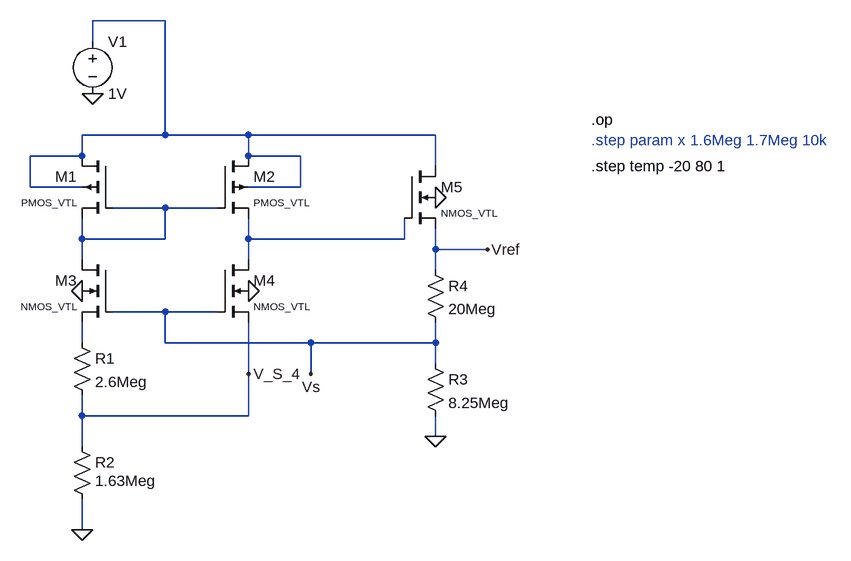
[diagram p0: schematic ptat_first_version.asc]
ptat_first_version.asc, the LTspice schematic file:
Version 4
SHEET 1 2136 772
WIRE 192 -32 80 -32
WIRE 80 0 80 -32
WIRE 192 144 192 -32
WIRE 192 144 64 144
WIRE 320 144 192 144
WIRE 608 144 320 144
WIRE 64 176 64 144
WIRE 64 176 -16 176
WIRE 320 176 320 144
WIRE 400 176 320 176
WIRE 608 192 608 144
WIRE -16 224 -16 176
WIRE 64 224 -16 224
WIRE 400 224 400 176
WIRE 400 224 320 224
WIRE 192 256 112 256
WIRE 272 256 192 256
WIRE 64 304 64 272
WIRE 192 304 192 256
WIRE 192 304 64 304
WIRE 320 304 320 272
WIRE 560 304 560 272
WIRE 560 304 320 304
WIRE 608 320 608 288
WIRE 688 320 608 320
WIRE 64 336 64 304
WIRE 320 336 320 304
WIRE 608 352 608 320
WIRE 192 416 112 416
WIRE 272 416 192 416
WIRE 64 464 64 432
WIRE 192 464 192 416
WIRE 416 464 192 464
WIRE 608 464 608 432
WIRE 608 464 416 464
WIRE 608 496 608 464
WIRE 320 512 320 432
WIRE 416 512 416 464
WIRE 64 576 64 544
WIRE 320 576 320 512
WIRE 320 576 64 576
WIRE 608 608 608 576
WIRE 64 624 64 576
WIRE 64 752 64 704
FLAG 80 80 0
FLAG 64 752 0
FLAG 416 512 Vs
FLAG 608 608 0
FLAG 688 320 Vref
FLAG 320 384 0
FLAG 64 384 0
FLAG 608 240 0
FLAG 320 512 V_S_4
SYMBOL pmos4 112 176 M0
WINDOW 3 56 72 Left 1
SYMATTR Value PMOS_VTL
SYMATTR InstName M1
SYMATTR Value2 l=150n w=1u
SYMBOL pmos4 272 176 R0
WINDOW 3 56 72 Left 1
SYMATTR Value PMOS_VTL
SYMATTR InstName M2
SYMATTR Value2 l=150n w=1u
SYMBOL voltage 80 -16 R0
SYMATTR InstName V1
SYMATTR Value 1V
SYMBOL nmos4 112 336 M0
WINDOW 3 56 72 Left 1
SYMATTR Value NMOS_VTL
SYMATTR InstName M3
SYMATTR Value2 l=55n w=1u m=11
SYMBOL nmos4 272 336 R0
WINDOW 3 56 72 Left 1
SYMATTR Value NMOS_VTL
SYMATTR InstName M4
SYMATTR Value2 l=55n w=1u
SYMBOL res 48 448 R0
SYMATTR InstName R1
SYMATTR Value 2.6Meg
SYMBOL res 48 608 R0
WINDOW 3 36 68 Left 2
SYMATTR Value 1.63Meg
SYMATTR InstName R2
SYMBOL res 592 480 R0
SYMATTR InstName R3
SYMATTR Value 8.25Meg
SYMBOL res 592 336 R0
SYMATTR InstName R4
SYMATTR Value 20Meg
SYMBOL nmos4 560 192 R0
WINDOW 3 56 72 Left 1
SYMATTR Value NMOS_VTL
SYMATTR InstName M5
SYMATTR Value2 l=55n w=1u
TEXT 848 192 Left 2 !.step temp -20 80 1
TEXT 848 152 Left 2 ;.step param x 1.6Meg 1.7Meg 10k
TEXT 848 120 Left 2 !.op

The netlist it stands for:
* ptat_first_version.asc
M1 N001 N002 N002 N001 PMOS_VTL l=150n w=1u
M2 N001 N002 N003 N001 PMOS_VTL l=150n w=1u
V1 N001 0 1V
M3 N002 Vs N004 0 NMOS_VTL l=55n w=1u m=11
M4 N003 Vs V_S_4 0 NMOS_VTL l=55n w=1u
R1 N004 V_S_4 2.6Meg
R2 V_S_4 0 1.63Meg
R3 Vs 0 8.25Meg
R4 Vref Vs 20Meg
M5 N001 N003 Vref 0 NMOS_VTL l=55n w=1u
.model NMOS NMOS
.model PMOS PMOS
.lib standard.mos
.step temp -20 80 1
* .step param x 1.6Meg 1.7Meg 10k
.op
.backanno
.end